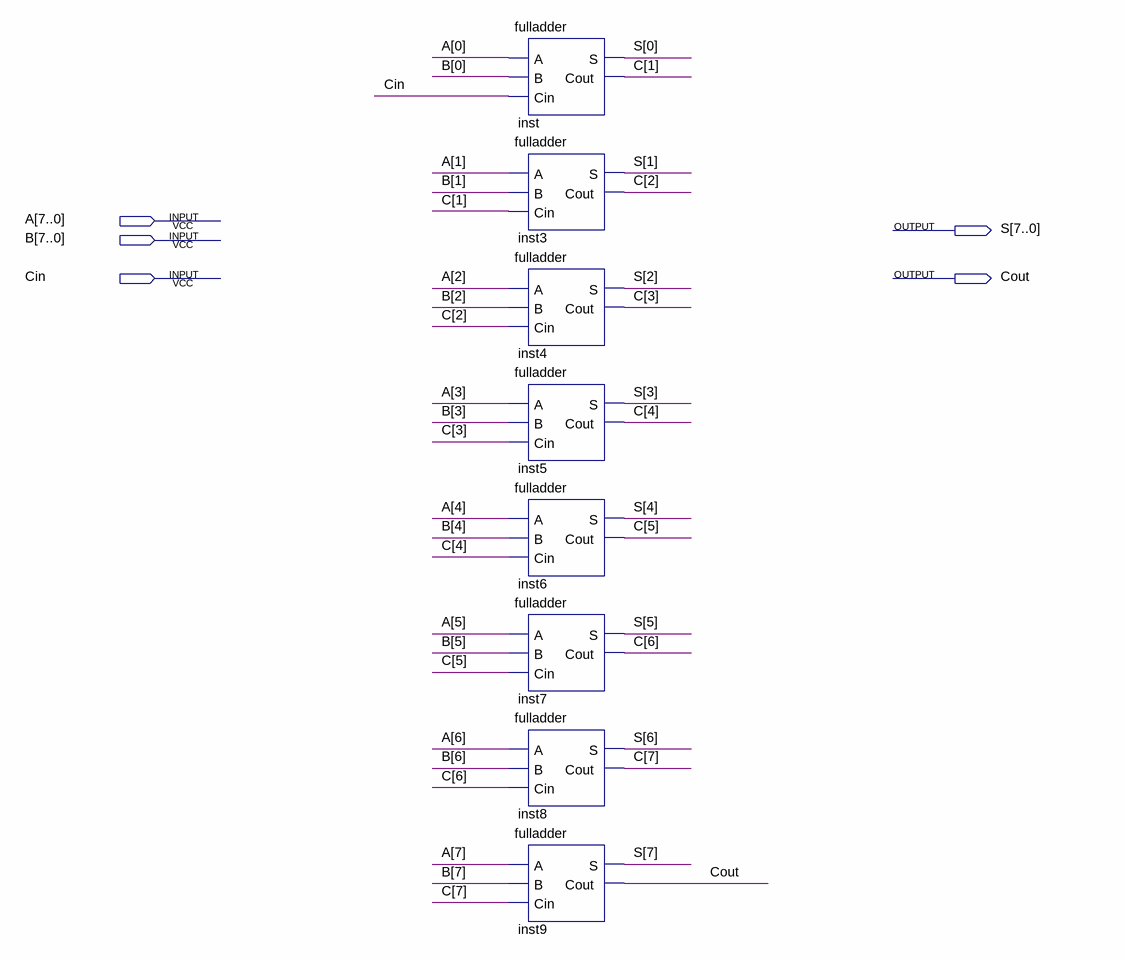
[diagram p0: schematic sheet]
// Quartus schematic add8.bdf as structural Verilog: 8 symbols, 5 pins
module add8 (
  input  [7:0] A,
  input  [7:0] B,
  input  Cin,
  output [7:0] S,
  output Cout
);

  wire [7:1] C;

  fulladder inst (.A(A[0]), .B(B[0]), .Cin(Cin), .S(S[0]), .Cout(C[1]));
  fulladder inst3 (.A(A[1]), .B(B[1]), .Cin(C[1]), .S(S[1]), .Cout(C[2]));
  fulladder inst4 (.A(A[2]), .B(B[2]), .Cin(C[2]), .S(S[2]), .Cout(C[3]));
  fulladder inst5 (.A(A[3]), .B(B[3]), .Cin(C[3]), .S(S[3]), .Cout(C[4]));
  fulladder inst6 (.A(A[4]), .B(B[4]), .Cin(C[4]), .S(S[4]), .Cout(C[5]));
  fulladder inst7 (.A(A[5]), .B(B[5]), .Cin(C[5]), .S(S[5]), .Cout(C[6]));
  fulladder inst8 (.A(A[6]), .B(B[6]), .Cin(C[6]), .S(S[6]), .Cout(C[7]));
  fulladder inst9 (.A(A[7]), .B(B[7]), .Cin(C[7]), .S(S[7]), .Cout(Cout));
endmodule
